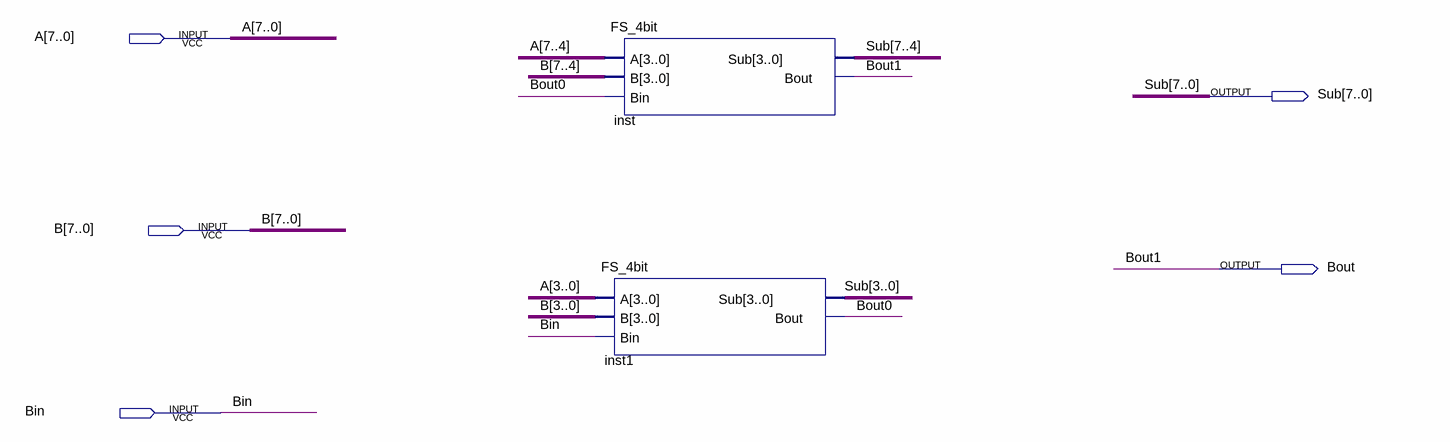
[diagram p0: schematic sheet]
// Quartus schematic FS_8bit.bdf as structural Verilog: 2 symbols, 5 pins
module FS_8bit (
  input  [7:0] A,
  input  [7:0] B,
  input  Bin,
  output [7:0] Sub,
  output Bout
);

  wire Bout0;

  FS_4bit inst (.A(A[7:4]), .B(B[7:4]), .Bin(Bout0), .Sub(Sub[7:4]), .Bout(Bout));
  FS_4bit inst1 (.A(A[3:0]), .B(B[3:0]), .Bin(Bin), .Sub(Sub[3:0]), .Bout(Bout0));

  // Other names for the same wires on the sheet: Bout1 = Bout
endmodule
